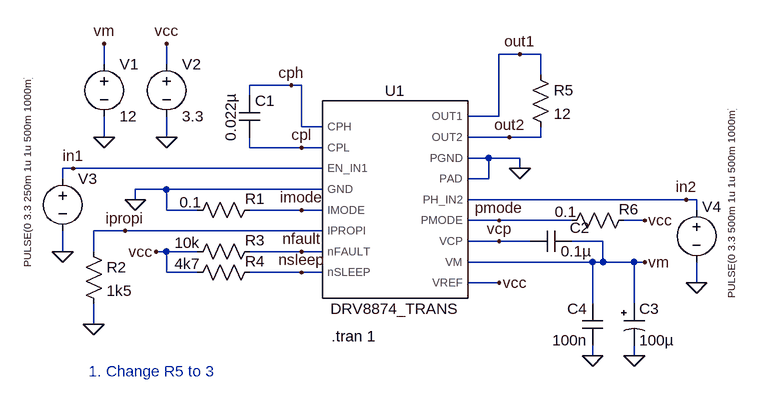
[diagram p0: schematic drv8874_transient.asc]
drv8874_transient.asc, the LTspice schematic file:
Version 4
SHEET 1 880 680
WIRE 416 -48 384 -48
WIRE 448 -48 416 -48
WIRE -224 -32 -224 -64
WIRE -128 -32 -128 -64
WIRE 448 -16 448 -48
WIRE 64 0 0 0
WIRE 80 0 64 0
WIRE 0 16 0 0
WIRE 384 48 384 -48
WIRE 384 48 336 48
WIRE 80 64 80 0
WIRE 112 64 80 64
WIRE -224 80 -224 48
WIRE -128 80 -128 48
WIRE 400 80 336 80
WIRE 448 80 448 64
WIRE 448 80 400 80
WIRE 0 96 0 80
WIRE 80 96 0 96
WIRE 112 96 80 96
WIRE 368 112 336 112
WIRE 416 112 368 112
WIRE -272 128 -288 128
WIRE 112 128 -272 128
WIRE 416 128 416 112
WIRE -288 144 -288 128
WIRE 368 144 368 112
WIRE 368 144 336 144
WIRE -128 160 -176 160
WIRE 112 160 -128 160
WIRE -176 176 -176 160
WIRE 672 176 336 176
WIRE 688 176 672 176
WIRE -128 192 -128 160
WIRE -80 192 -128 192
WIRE 80 192 0 192
WIRE 112 192 80 192
WIRE 688 192 688 176
WIRE 384 208 336 208
WIRE 496 208 384 208
WIRE 608 208 576 208
WIRE -192 224 -240 224
WIRE 112 224 -192 224
WIRE 384 240 336 240
WIRE 432 240 384 240
WIRE 544 240 496 240
WIRE -288 256 -288 224
WIRE -240 256 -240 224
WIRE -128 256 -144 256
WIRE -80 256 -128 256
WIRE 80 256 0 256
WIRE 112 256 80 256
WIRE 528 272 336 272
WIRE 544 272 544 240
WIRE 544 272 528 272
WIRE 592 272 544 272
WIRE 608 272 592 272
WIRE -128 288 -128 256
WIRE -80 288 -128 288
WIRE 80 288 0 288
WIRE 112 288 80 288
WIRE 384 304 336 304
WIRE 688 304 688 272
WIRE 528 336 528 272
WIRE 592 336 592 272
WIRE -240 368 -240 336
WIRE 528 416 528 400
WIRE 592 416 592 400
FLAG -288 256 0
FLAG -176 176 0
FLAG -224 80 0
FLAG -128 80 0
FLAG -224 -64 vm
FLAG -128 -64 vcc
FLAG -240 368 0
FLAG -144 256 vcc
FLAG 416 128 0
FLAG -272 128 in1
FLAG 688 304 0
FLAG 672 176 in2
FLAG 608 208 vcc
FLAG 608 272 vm
FLAG 384 304 vcc
FLAG 592 416 0
FLAG 528 416 0
FLAG 64 0 cph
FLAG 80 96 cpl
FLAG 80 192 imode
FLAG -192 224 ipropi
FLAG 80 256 nfault
FLAG 80 288 nsleep
FLAG 416 -48 out1
FLAG 400 80 out2
FLAG 384 208 pmode
FLAG 384 240 vcp
SYMBOL DRV8874_TRANS 224 176 R0
SYMATTR InstName U1
SYMBOL cap -16 16 R0
WINDOW 3 -13 -4 VRight 2
SYMATTR InstName C1
SYMATTR Value 0.022µ
SYMATTR SpiceLine V=50 Irms=0 Rser=0.0497 Lser=320p mfg="Würth Elektronik" pn="885012207094 WCAP-CSGP 0805" type="X7R"
SYMBOL voltage -288 128 R0
WINDOW 3 -54 -136 VRight 1
WINDOW 123 0 0 Left 0
WINDOW 39 0 0 Left 0
SYMATTR InstName V3
SYMATTR Value PULSE(0 3.3 250m 1u 1u 500m 1000m)
SYMBOL res 16 176 R90
WINDOW 0 14 8 VBottom 2
WINDOW 3 -12 107 VTop 2
SYMATTR InstName R1
SYMATTR Value 0.1
SYMBOL voltage -224 -48 R0
WINDOW 123 0 0 Left 0
WINDOW 39 0 0 Left 0
SYMATTR InstName V1
SYMATTR Value 12
SYMBOL voltage -128 -48 R0
WINDOW 123 0 0 Left 0
WINDOW 39 0 0 Left 0
SYMATTR InstName V2
SYMATTR Value 3.3
SYMBOL res -256 240 R0
SYMATTR InstName R2
SYMATTR Value 1k5
SYMBOL res 16 240 R90
WINDOW 0 14 8 VBottom 2
WINDOW 3 -13 112 VTop 2
SYMATTR InstName R3
SYMATTR Value 10k
SYMBOL res 16 272 R90
WINDOW 0 14 8 VBottom 2
WINDOW 3 -13 112 VTop 2
SYMATTR InstName R4
SYMATTR Value 4k7
SYMBOL res 432 -32 R0
SYMATTR InstName R5
SYMATTR Value 12
SYMBOL voltage 688 176 M0
WINDOW 0 -38 11 Left 2
WINDOW 3 -54 -136 VRight 1
WINDOW 123 0 0 Left 0
WINDOW 39 0 0 Left 0
SYMATTR InstName V4
SYMATTR Value PULSE(0 3.3 500m 1u 1u 500m 1000m)
SYMBOL res 592 192 R90
WINDOW 0 14 8 VBottom 2
WINDOW 3 -13 105 VTop 2
SYMATTR InstName R6
SYMATTR Value 0.1
SYMBOL cap 496 224 R90
WINDOW 0 11 -12 VBottom 2
WINDOW 3 16 -7 VTop 2
SYMATTR InstName C2
SYMATTR Value 0.1µ
SYMATTR SpiceLine V=50 Irms=0 Rser=0.0158 Lser=310p mfg="Würth Elektronik" pn="885012206095 WCAP-CSGP 0603" type="X7R"
SYMBOL polcap 576 336 R0
WINDOW 3 24 56 Left 2
SYMATTR InstName C3
SYMATTR Value 100µ
SYMATTR Description Capacitor
SYMATTR Type cap
SYMATTR SpiceLine V=50 Irms=500m Rser=0.23 Lser=0 mfg="Panasonic" pn="ECA1HFQ101" type="Al electrolytic"
SYMBOL cap 544 400 R180
WINDOW 0 24 56 Left 2
WINDOW 3 24 8 Left 2
SYMATTR InstName C4
SYMATTR Value 100n
TEXT 126 386 Left 2 !.tran 1
TEXT -248 440 Left 2 ;1. Change R5 to 3

The netlist it stands for:
* drv8874_transient.asc
XU1 cph cpl in1 0 imode ipropi nfault nsleep out1 out2 0 0 in2 pmode vcp vm vcc DRV8874_TRANS  ; pins CPH CPL EN_IN1 GND IMODE IPROPI nFAULT nSLEEP OUT1 OUT2 PGND PAD PH_IN2 PMODE VCP VM VREF
C1 cph cpl 0.022µ V=50 Irms=0 Rser=0.0497 Lser=320p mfg="Würth Elektronik" pn="885012207094 WCAP-CSGP 0805" type="X7R"
V3 in1 0 PULSE(0 3.3 250m 1u 1u 500m 1000m)
R1 imode 0 0.1
V1 vm 0 12
V2 vcc 0 3.3
R2 ipropi 0 1k5
R3 nfault vcc 10k
R4 nsleep vcc 4k7
R5 out1 out2 12
V4 in2 0 PULSE(0 3.3 500m 1u 1u 500m 1000m)
R6 vcc pmode 0.1
C2 vm vcp 0.1µ V=50 Irms=0 Rser=0.0158 Lser=310p mfg="Würth Elektronik" pn="885012206095 WCAP-CSGP 0603" type="X7R"
C3 vm 0 100µ V=50 Irms=500m Rser=0.23 Lser=0 mfg="Panasonic" pn="ECA1HFQ101" type="Al electrolytic"
C4 0 vm 100n
.tran 1
* 1. Change R5 to 3
.lib C:\Users\HoP\Documents\GitHub\LTspice\08-drv8874\DRV8874_TRANS.lib
.backanno
.end

* Results of the author's LTspice run, read from the files saved beside the schematic
* Operating Point, zero values left out:
*   V(pmode) = 3.3 V
*   V(nfault) = 3.267 V
*   V(imode) = 7.353 µV
*   V(nsleep) = 3.152 V
*   V(vm) = 12 V
*   V(out2) = 12 V
*   V(vcc) = 3.3 V
*   V(out1) = 12 V
*   I(R6) = 64.1 µA
*   I(R4) = -31.52 µA
*   I(R3) = -3.267 µA
*   I(R2) = 3.301 pA
*   I(R1) = 73.53 µA
*   I(V2) = -98.89 µA
*   Ix(u1:GND) = -25.36 µA
*   Ix(u1:IMODE) = -73.53 µA
*   Ix(u1:IPROPI) = -3.301 pA
*   Ix(u1:NFAULT) = 3.267 µA
*   Ix(u1:NSLEEP) = 31.52 µA
*   Ix(u1:PGND) = -72.27 nA
*   Ix(u1:PMODE) = 64.1 µA
*   Ix(u1:VREF) = 3.301 pA
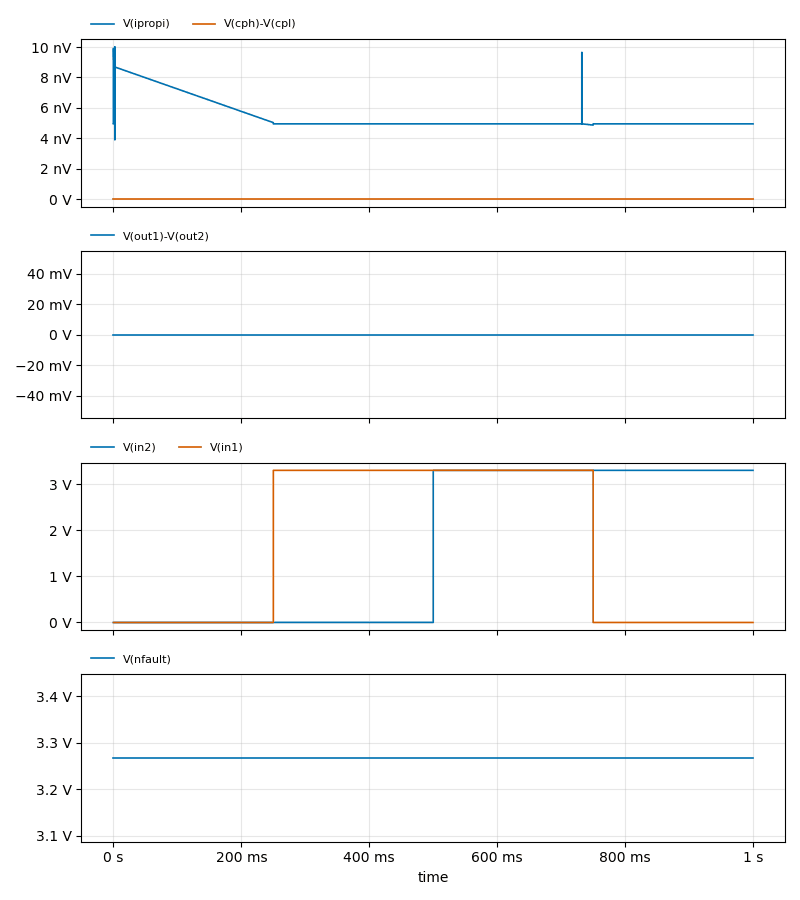
[diagram p1: Transient Analysis of drv8874_transient.asc, plotted from the saved traces]
* Transient Analysis, 1 run:
*   V(ipropi): min 3.896 nV, max 10 nV, average 5.429 nV, rms 5.568 nV, last 4.951 nV
*   V(cph)-V(cpl): min 0 V, max 0 V, average 0 V, rms 0 V, last 0 V
*   V(out1)-V(out2): min 0 V, max 0 V, average 0 V, rms 0 V, last 0 V
*   V(in2): min 0 V, max 3.3 V, average 1.65 V, rms 2.333 V, last 3.3 V
*   V(in1): min 0 V, max 3.3 V, average 1.65 V, rms 2.333 V, last 0 V
*   V(nfault): min 3.267 V, max 3.267 V, average 3.267 V, rms 3.267 V, last 3.267 V